# EAGLE schematic Motor Controller (EAGLE 9.6.0)
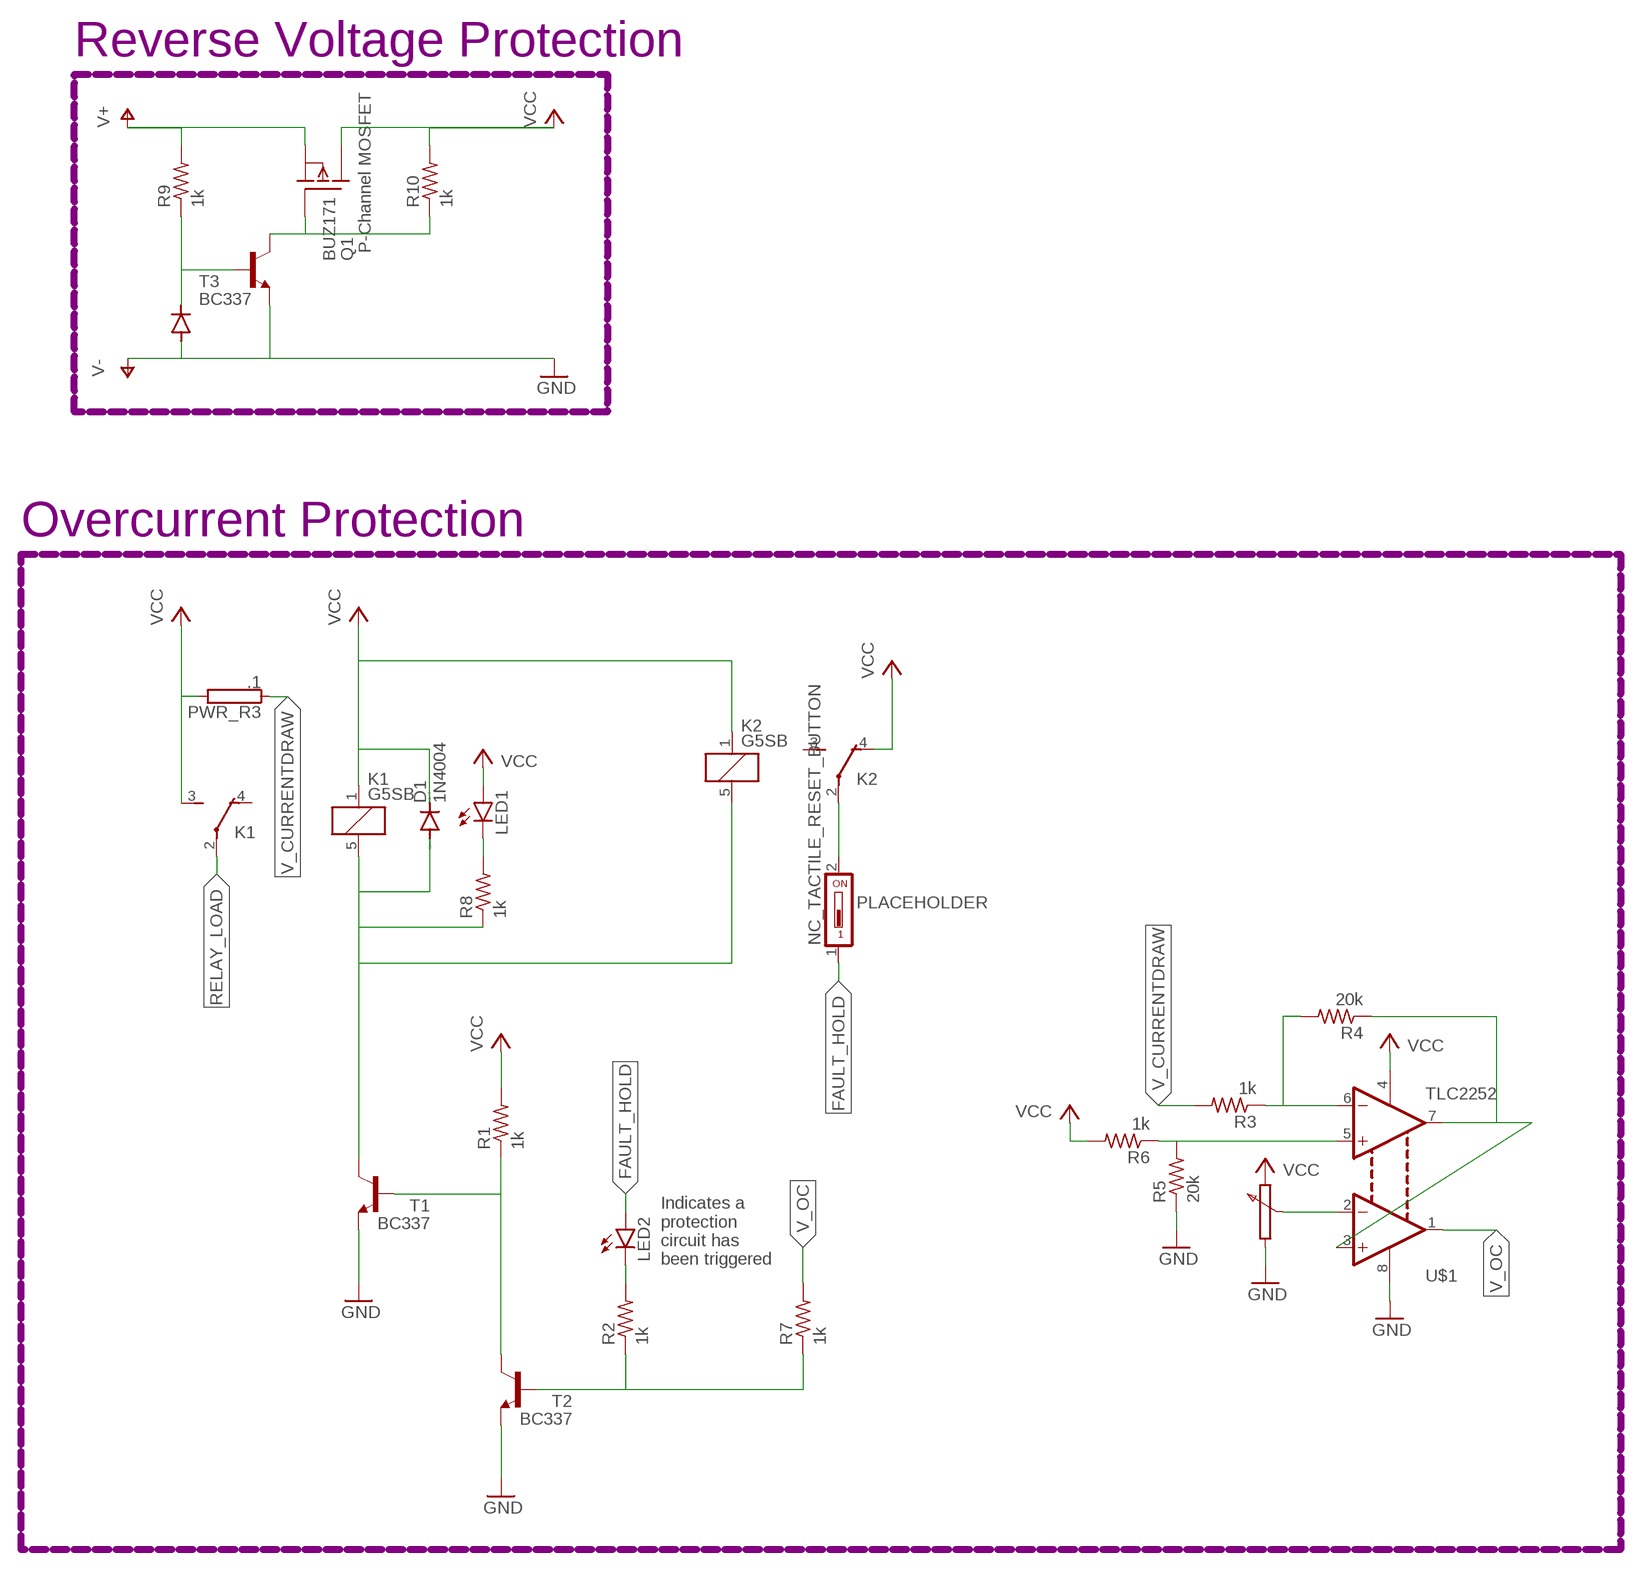
[diagram p0: schematic, sheet 1]

## Parts
D1  1N4004  [DO41-10]
K1  G5SB  [G5SB]
K2  G5SB  [G5SB]
LED1  LED5MM  [LED5MM]
LED2  LED5MM  [LED5MM]
NC_TACTILE_RESET_BUTTON  DS01  [DS-01]
PWR_R3  .1  RAC07  [AC07]
Q1  BUZ171  [TO220]
R1  1k  R-US_0411/15  [0411/15]
R2  1k  R-US_0411/15  [0411/15]
R3  1k  R-US_0411/15  [0411/15]
R4  20k  R-US_0411/15  [0411/15]
R5  20k  R-US_0411/15  [0411/15]
R6  1k  R-US_0411/15  [0411/15]
R7  1k  R-US_0411/15  [0411/15]
R8  1k  R-US_0411/15  [0411/15]
R9  1k  R-US_0411/15  [0411/15]
R10  1k  R-US_0411/15  [0411/15]
T1  BC337  [TO92]
T2  BC337  [TO92]
T3  BC337  [TO92]
U$1  TLC2252  [DIL08]

## Nets
FAULT_HOLD: NC_TACTILE_RESET_BUTTON.1
GND: R5.1 T1.1(E) T2.1(E) T3.1(E) U$1.8(V+) ; supply symbol labelled V-
N$1: D1.A
N$2: K1.5 K2.5 R8.1 T1.3(C)
N$3: R1.1 T1.2(B) T2.3(C)
N$4: R2.1 R7.1 T2.2(B)
N$5: R5.2 R6.1 U$1.5(2IN+)
N$6: R3.2
N$7: R3.1 R4.2 U$1.6(2IN-)
N$8: R4.1 U$1.3(1IN+) U$1.7(2OUT)
N$9: U$1.2(1IN-)
N$10: LED2.K(C) R2.2
N$11: K2.2(U:P) NC_TACTILE_RESET_BUTTON.2
N$12: R9.1 T3.2(B)
N$13: LED1.K(C) R8.2
N$14: LED2.A
N$15: Q1.1(G) R10.1 T3.3(C)
RELAY_LOAD: K1.2(U:P)
V+: Q1.3(S) R9.2
V_CURRENTDRAW: PWR_R3.1
V_OC: R7.2 U$1.1(1OUT)
VCC: D1.C K1.1 K1.3(U:S) K2.1 K2.4(U:O) LED1.A PWR_R3.2 Q1.2(D) R1.2 R6.2 R10.2 U$1.4(V-)
Unconnected: K1.4(U:O) K2.3(U:S)

## Notes on the sheet
- Reverse Voltage Protection
- P-Channel MOSFET
- Overcurrent Protection
- PLACEHOLDER
- Indicates a 
  protection 
  circuit has 
  been triggered

## Library data of the parts
D1 = diode:1N4004: DIODE general purpose rectifier, 1 A
K1 K2 = relay:G5SB: Compact Single-pole Relay for Switching 5 A Source: http://www.omron.com/ecb/products/pry/121/g5sb.html; OC_FARNELL: unknown; OC_NEWARK: unknown
LED1 LED2 = led:LED: LED OSRAM: - CHIPLED LG R971, LG N971, LY N971, LG Q971, LY Q971, LO R971, LY R971 LH N974, LH R974 LS Q976, LO Q976, LY Q976 LO Q996 - Hyper CHIPLED LW Q18S LB Q993, LB Q99A, LB R99A - SideLED LS A670, LO A670, LY A670, LG A670, LP A670 LB A673, LV A673, LT A673, LW A673 LH A674 LY A675 LS A676, LA A676, LO A676, LY A676, LW A676 LS A679, LY A679, LG A679 - Hyper Micro SIDELED® LS Y876, LA Y876, LO Y876, LY Y876 LT Y87S - SmartLED LW L88C, LW L88S LB L89C, LB L89S, LG L890 LS L89K, LO L89K, LY L89K LS L896, LA L896, LO L896, LY L896 - TOPLED LS T670, LO T670, LY T670, LG T670, LP T670 LSG T670, LSP T670, LSY T670, LOP T670, LYG T670 LG T671, LOG T671, LSG T671 LB T673, LV T673, LT T673, LW T673 LH T674 LS T676, LA T676, LO T676, LY T676, LB T676, LH T676, LSB T676, LW T676 LB T67C, LV T67C, LT T67C, LS T67K, LO T67K, LY T67K, LW E67C LS E67B, LA E67B, LO E67B, LY E67B, LB E67C, LV E67C, LT E67C LW T67C LS T679, LY T679, LG T679 LS T770, LO T770, LY T770, LG T770, LP T770 LB T773, LV T773, LT T773, LW T773 LH T774 LS E675, LA E675, LY E675, LS T675 LS T776, LA T776, LO T776, LY T776, LB T776 LHGB T686 LT T68C, LB T68C - Hyper Mini TOPLED® LB M676 - Mini TOPLED Santana® LG M470 LS M47K, LO M47K, LY M47K Source: http://www.osram.convergy.de LUXEON: - LUMILED® LXK2-PW12-R00, LXK2-PW12-S00, LXK2-PW14-U00, LXK2-PW14-V00 LXK2-PM12-R00, LXK2-PM12-S00, LXK2-PM14-U00 LXK2-PE12-Q00, LXK2-PE12-R00, LXK2-PE12-S00, LXK2-PE14-T00, LXK2-PE14-U00 LXK2-PB12-K00, LXK2-PB12-L00, LXK2-PB12-M00, LXK2-PB14-N00, LXK2-PB14-P00, LXK2-PB14-Q00 LXK2-PR12-L00, LXK2-PR12-M00, LXK2-PR14-Q00, LXK2-PR14-R00 LXK2-PD12-Q00, LXK2-PD12-R00, LXK2-PD12-S00 LXK2-PH12-R00, LXK2-PH12-S00 LXK2-PL12-P00, LXK2-PL12-Q00, LXK2-PL12-R00 Source: www.luxeon.com KINGBRIGHT: KA-3528ASYC Source: www.kingbright.com
NC_TACTILE_RESET_BUTTON = switch-dil:DS01: DIL/CODE SWITCH; OC_FARNELL: unknown; OC_NEWARK: unknown
PWR_R3 = resistor-power:R: Power Resitor; OC_FARNELL: unknown; OC_NEWARK: unknown
Q1 = transistor-fet:BUZ171: P-Channel Enhancement MOSFET -50V; 7A; 0,4Ohm
R1-R10 = rcl:R-US_: RESISTOR, American symbol; SPICEPREFIX: R
T1-T3 = transistor:BC337: NPN TRANSISTOR
U$1 = GTOR:TLC2252: General Purpose Operational Amplifier Dual Circuit Rail-to-Rail 8-PDIP